# Altium schematic sheet Э3.SchDoc: =title_line_1 + title_line_2
size 594 x 420 mm; SheetNumber: 1; SheetTotal: 2
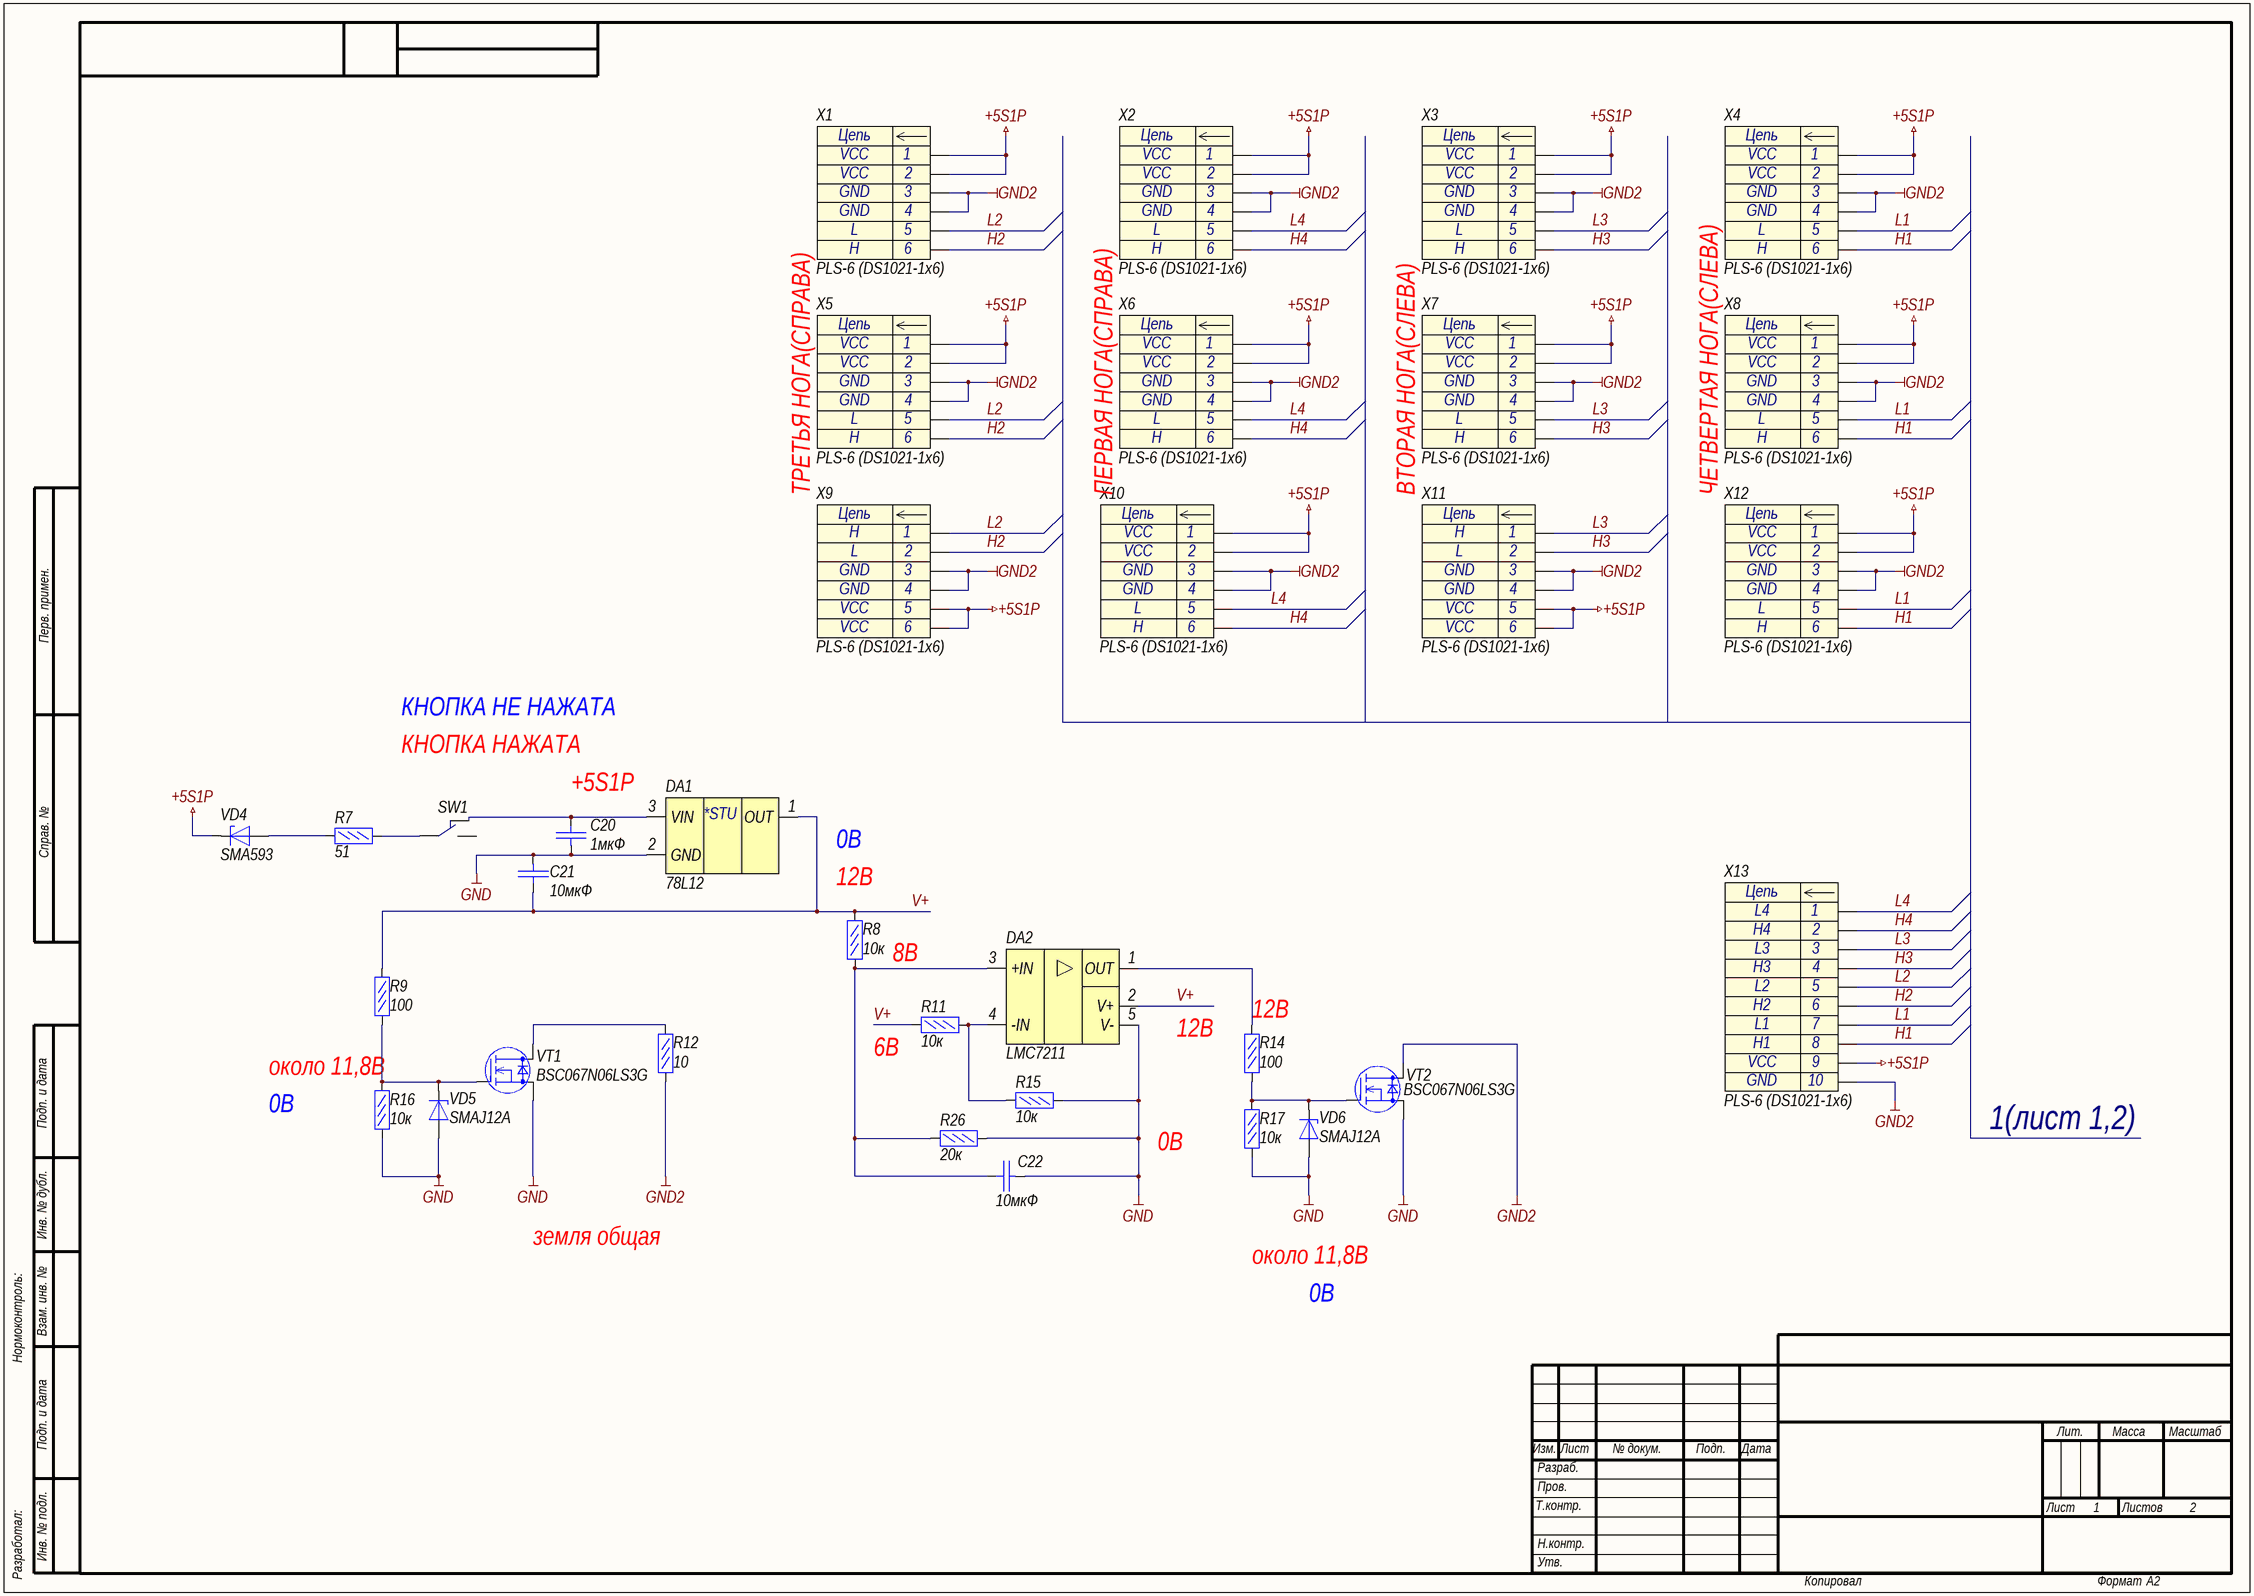
[diagram p0: Э3.SchDoc]

## Parts
C20  1мкФ  [C0603]
C21  10мкФ  [C0603]
C22  10мкФ  [C0603]
DA1  78L12  [D-PAK]
DA2  LMC7211  [SOT23-5]
R7  51  [R0603]
R8  10к  [R0603]
R9  100  [R0603]
R11  10к  [R0603]
R12  10  [R0603]
R14  100  [R0603]
R15  10к  [R0603]
R16  10к  [R0603]
R17  10к  [R0603]
R26  20к  [R0603]
SW1  кнопка_S  [SWITCH]  (value not drawn)
VD4  SMA593
VD5  SMAJ12A
VD6  SMAJ12A
VT1  BSC067N06LS3G
VT2  BSC067N06LS3G
X1  PLS-6 (DS1021-1x6)  [PLS-6]
X2  PLS-6 (DS1021-1x6)  [PLS-6]
X3  PLS-6 (DS1021-1x6)  [PLS-6]
X4  PLS-6 (DS1021-1x6)  [PLS-6]
X5  PLS-6 (DS1021-1x6)  [PLS-6]
X6  PLS-6 (DS1021-1x6)  [PLS-6]
X7  PLS-6 (DS1021-1x6)  [PLS-6]
X8  PLS-6 (DS1021-1x6)  [PLS-6]
X9  PLS-6 (DS1021-1x6)  [PLS-6]
X10  PLS-6 (DS1021-1x6)  [PLS-6]
X11  PLS-6 (DS1021-1x6)  [PLS-6]
X12  PLS-6 (DS1021-1x6)  [PLS-6]
X13  PLS-6 (DS1021-1x6)  [PLS-6]

## Nets
+5S1P: VD4.1(K) X1.1 X1.2 X2.1 X2.2 X3.1 X3.2 X4.1 X4.2 X5.1 X5.2 X6.1 X6.2 X7.1 X7.2 X8.1 X8.2 X9.5 X9.6 X10.1 X10.2 X11.5 X11.6 X12.1 X12.2 X13.9
GND: C20.2 C21.2 C22.2 DA1.2(GND) DA2.5(V-) R15.1 R16.2 R17.1 R26.2 VD5.2(A) VD6.2(A) VT1.3(S) VT2.3(S)
GND2: R12.2 VT2.2(D) X1.3 X1.4 X2.3 X2.4 X3.3 X3.4 X4.3 X4.4 X5.3 X5.4 X6.3 X6.4 X7.3 X7.4 X8.3 X8.4 X9.3 X9.4 X10.3 X10.4 X11.3 X11.4 X12.3 X12.4 X13.10
H1: X4.6 X8.6 X12.6 X13.8
H2: X1.6 X5.6 X9.2 X13.6
H3: X3.6 X7.6 X11.2 X13.4
H4: X2.6 X6.6 X10.6 X13.2
L1: X4.5 X8.5 X12.5 X13.7
L2: X1.5 X5.5 X9.1 X13.5
L3: X3.5 X7.5 X11.1 X13.3
L4: X2.5 X6.5 X10.5 X13.1
V+: C21.1 DA1.1(OUT) DA2.2(V+) R8.1 R9.2 R11.1
NetC20_1: C20.1 DA1.3(VIN) SW1.3
NetC22_1: C22.1 DA2.3(+IN) R8.2 R26.1
NetDA2_1: DA2.1(OUT) R14.2
NetDA2_4: DA2.4(-IN) R11.2 R15.2
NetR7_1: R7.1 VD4.2(A)
NetR7_2: R7.2 SW1.2
NetR9_1: R9.1 R16.1 VD5.1(K) VT1.1(G)
NetR12_1: R12.1 VT1.2(D)
NetR14_1: R14.1 R17.2 VD6.1(K) VT2.1(G)

Not connected (* = marked no-connect by the designer): SW1 1

## Notes on the sheet
- ТРЕТЬЯ НОГА(СПРАВА)
- ПЕРВАЯ НОГА(СПРАВА)
- ВТОРАЯ НОГА(СЛЕВА)
- ЧЕТВЕРТАЯ НОГА(СЛЕВА)
- КНОПКА НЕ НАЖАТА
- КНОПКА НАЖАТА
- +5S1P
- (near R8) 12B
- 0В
- 8В
- (near R14) 12B
- (near R16) около 11,8В
- (near R11) 6В
- 12B
- 1(лист 1,2)
- земля общая
- около 11,8В
- Перв. примен.
- Справ. №
- Подп. и дата
- Инв. № дубл.
- Нормоконтроль:
- Взам. инв. №
- Изм.
- Лист
- № докум.
- Подп.
- Дата
- Лит.
- Масса
- Масштаб
- Т.контр.
- Пров.
- Разраб.
- Листов
- Разработал:
- Инв. № подл.
- Н.контр.
- Утв.
- Копировал
- Формат
- А2
- (in symbol 78L12) *STU
- (in symbol PLS-6) Цепь
- (in symbol PLS-10) Цепь

## Library data of the parts
C20-C22 = C0603: Конденсатор керамический 0603; Name: -; Manufacturer: -; TKE: -; Voltage: -
  C20: Value: 1мкФ
  C21 C22: Value: 10мкФ
DA1 = 78L12: Линейный стабилизатор напряжения 3,3В; Manufacturer: Texas Instruments; Name: 78L12
DA2 = LMC7211: Компаратор; Manufacturer: Analog Devices; Name: LMC7211
R7-R9 R11 R12 R15-R17 R26 = RC0603FR-0715KL_1: Резистор 47кОм 0,063Вт 1%; Manufacturer: YAGEO; Name: RC0603FR-0747KL; Tolerance: 1%
  R7: Value: 51
  R8 R11 R15-R17: Value: 10к
  R9: Value: 100
  R12: Value: 10
  R26: Value: 20к
R14 = RC0603FR-07100RL: Резистор 100 Ом 0,1Вт 1%; Manufacturer: YAGEO; Name: RC0603FR-07100RL; Tolerance: 1%; Value: 100
SW1 = BT992895: крутые переключатели с бимов; nam: кнопка_S
VD4-VD6 = SMAJ12A: Диод защитный 12В
  VD4: Name: SMA593
  VD5 VD6: Name: SMAJ12A
VT1 VT2 = N-MOSFET: Name: BSC067N06LS3G; Link: *
X1-X8 X10 X12 = PLS-6: Разъем - 6 конт. прямая вилка на плату, шаг 2,54 мм; Contact_1: VCC; Contact_3: GND; Contact_5: L; Contact_6: H; Contact_2: VCC; Contact_4: GND; Name: PLS-6 (DS1021-1x6)
X9 X11 = PLS-6: Разъем - 6 конт. прямая вилка на плату, шаг 2,54 мм; Contact_1: H; Contact_2: L; Contact_3: GND; Contact_5: VCC; Contact_4: GND; Contact_6: VCC; Name: PLS-6 (DS1021-1x6)
X13 = PLS-10: Разъем - 10 конт. прямая вилка на плату, шаг 2,54 мм; Contact_1: L4; Contact_2: H4; Contact_3: L3; Contact_4: H3; Contact_5: L2; Contact_6: H2; Contact_7: L1; Contact_8: H1; Contact_9: VCC; Contact_10: GND; Name: PLS-6 (DS1021-1x6)